# EasyEDA Pro project 15届国（未完成）.epro, board 15F_PCB
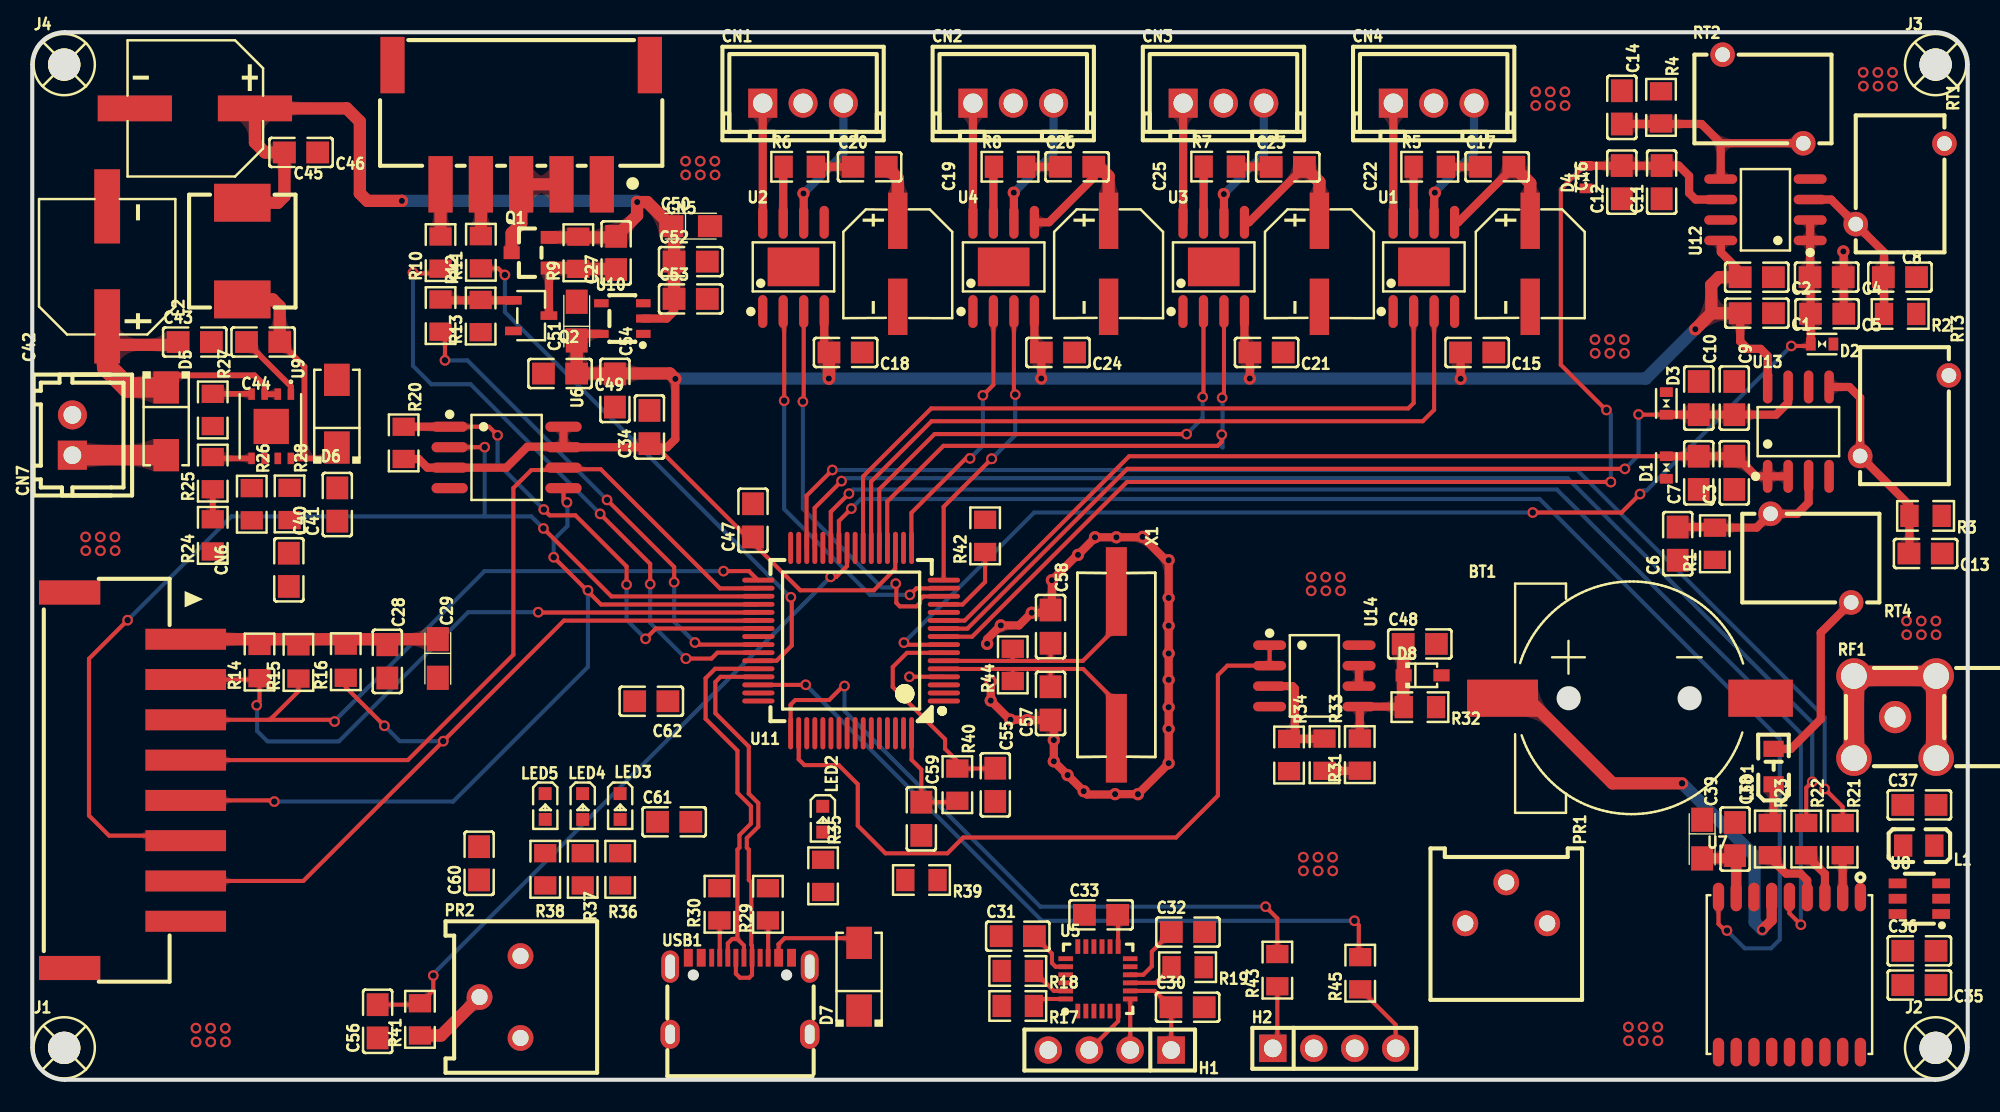
[diagram p4: board, top side]
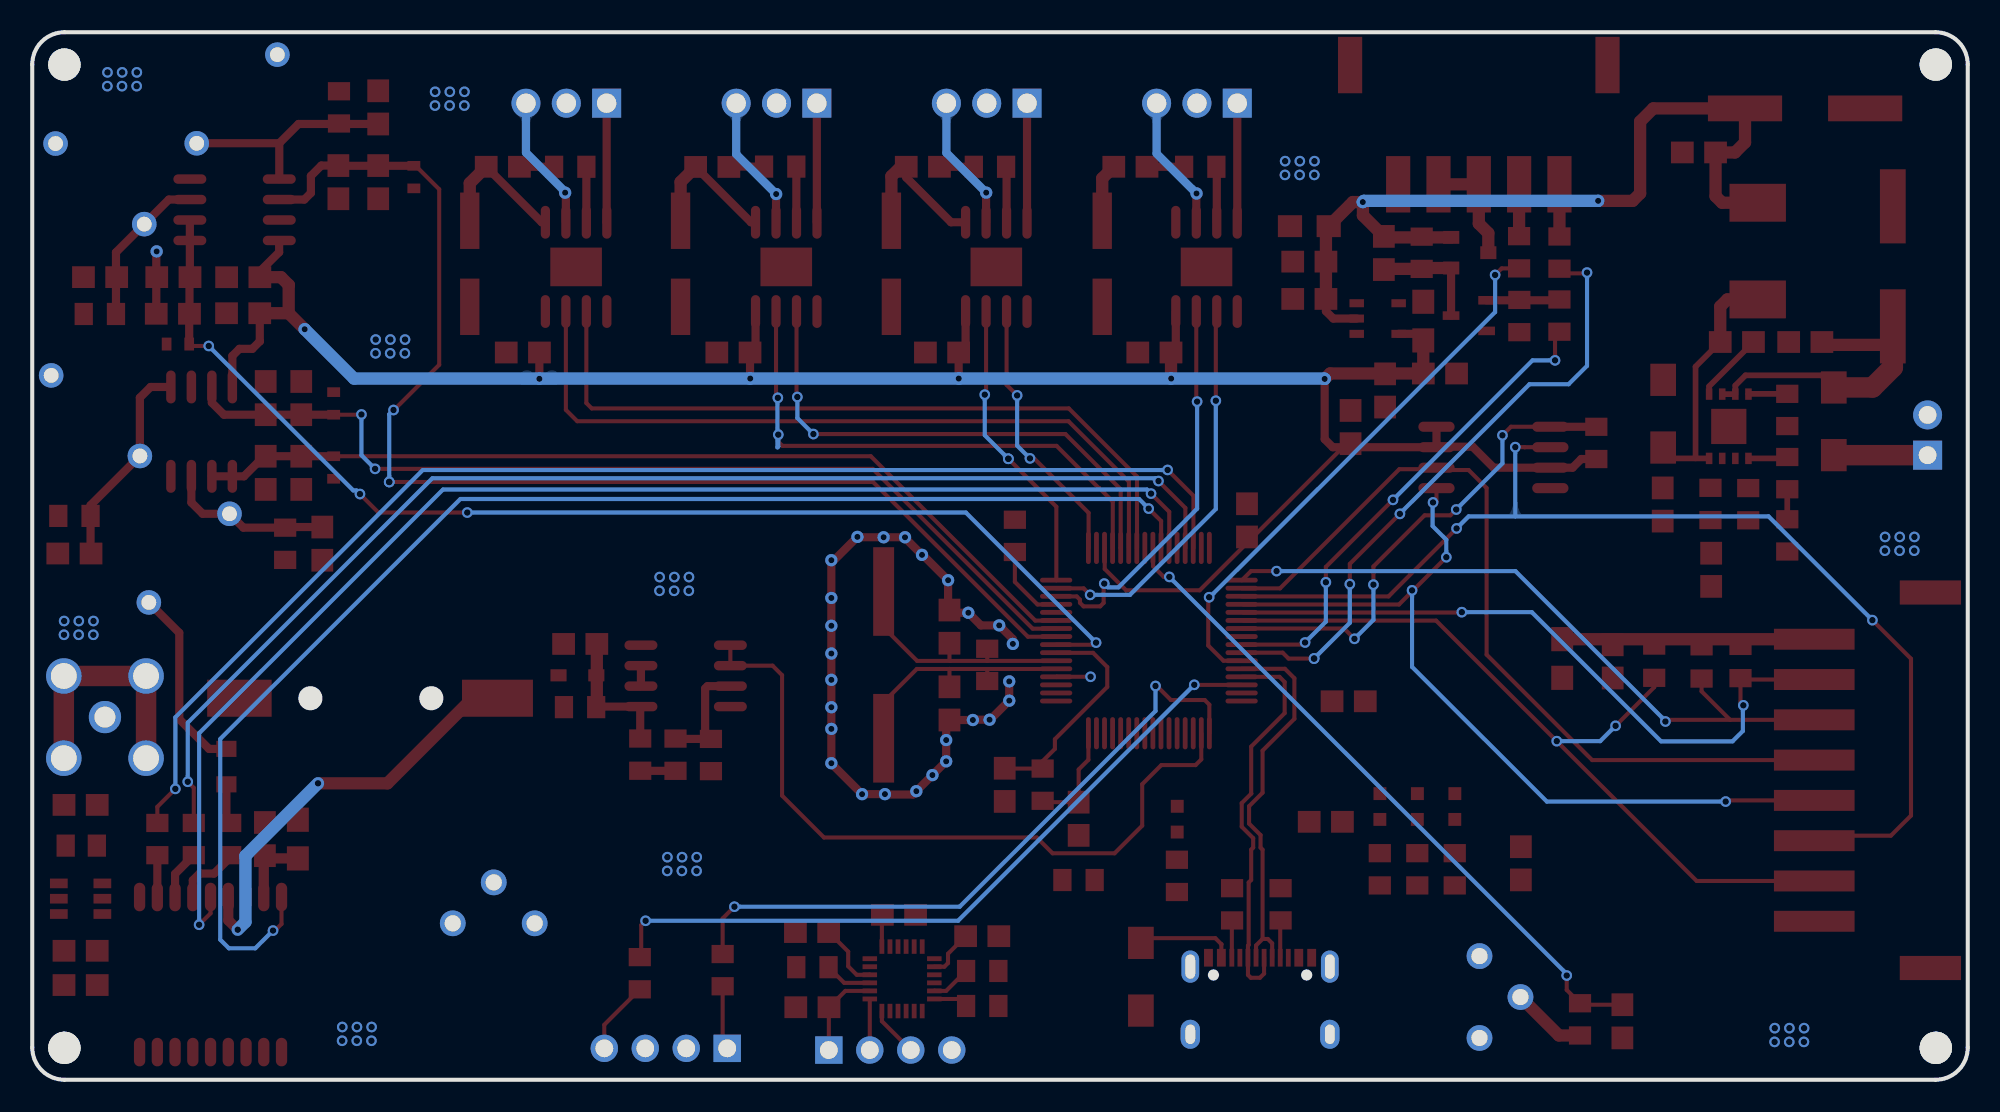
[diagram p5: board, bottom side, seen from below]

Outline 120 x 65 mm; copper layers: Top Layer, Bottom Layer. Coordinates in mm from the lower left corner of the outline.
Outline path: 0,63 0,2 arc(0.59,0.59) 2,0 118,0 arc(119.41,0.59) 120,2 120,63 arc(119.41,64.41) 118,65 2,65 arc(0.59,64.41) 0,63
Stack: Top Layer 0.035mm / Dielectric1 1.51mm FR4 er 4.5 / Bottom Layer 0.035mm

## Design rules (mm)
net USB_DN: DP2
net USB_DP: DP2
net OSC_OUT: DP1
net OSC_IN: DP1
template: 自定义配置
spacing copperThickness1oz (default): track to track 0.203, other pairs 0.165 to 0.203
spacing copperThickness2oz: track to track 0.203, other pairs 0.152 to 0.3
track width copperThickness1oz (default): min 0.254, default 0.254, max 2.54
track width copperThickness2oz: min 0.203, default 0.254, max 2.54
differential pair differentialPair (default): width min 0.254, default 0.254, max 2.54; gap min 0.203, default 0.203
via viaSize (default): diameter min 0.61, default 0.635, max 10; hole min 0.305, default 0.381, max 6.299

## Placement (name value [footprint] x y rotation side)
BT1  CR1220-A  [BAT-SMD_CR1220-2]  99.16 23.68 0 top
C1  100nF  [C0805]  106.92 47.56 180 top
C2  100nF  [C0805]  106.92 49.8 180 top
C3  100nF  [C0805]  105.53 37.66 90 top
C4  100nF  [C0805]  111.25 49.8 180 top
C5  10nF  [C0805]  111.28 47.53 180 top
C6  100nF  [C0805]  102.02 33.27 90 top
C7  10nF  [C0805]  103.32 37.66 90 top
C8  100nF  [C0805]  115.8 49.8 180 top
C9  100nF  [C0805]  105.53 42.3 270 top
C10  10nF  [C0805]  103.32 42.3 270 top
C11  100nF  [C0805]  101.02 55.7 90 top
C12  10nF  [C0805]  98.55 55.7 90 top
C13  100nF  [C0805]  117.39 32.65 180 top
C14  100nF  [C0805]  98.55 60.34 270 top
C15  100nF  [C0805]  89.58 45.13 180 top
C16  100uF  [CAP-SMD_BD6.3-L6.6-W6.6-LS7.2-FD]  92.88 50.63 270 top
C17  100nF  [C0805]  90.83 56.65 0 top
C18  100nF  [C0805]  50.43 45.13 180 top
C19  100uF  [CAP-SMD_BD6.3-L6.6-W6.6-LS7.2-FD]  53.66 50.63 270 top
C20  100nF  [C0805]  51.91 56.65 0 top
C21  100nF  [C0805]  76.53 45.13 180 top
C22  100uF  [CAP-SMD_BD6.3-L6.6-W6.6-LS7.2-FD]  79.8 50.63 270 top
C23  100nF  [C0805]  77.84 56.64 0 top
C24  100nF  [C0805]  63.59 45.13 180 top
C25  100uF  [CAP-SMD_BD6.3-L6.6-W6.6-LS7.2-FD]  66.73 50.63 270 top
C26  100nF  [C0805]  64.78 56.65 0 top
C27  100nF  [C0805]  36.2 51.3 90 top
C28  100nF  [C0805]  22.01 25.96 270 top
C29  22uF  [CASE-A_3216]  25.14 26.14 270 top
C30  100nF  [C0805]  71.63 4.5 0 top
C31  2200pF  [C0805]  61.1 8.91 0 top
C32  100nF  [C0805]  71.65 9.16 0 top
C33  100nF  [C0805]  66.26 10.23 0 top
C34  100nF  [C0805]  38.26 40.5 90 top
C35  100nF  [C0805]  117 5.88 180 top
C36  100nF  [C0805]  117 8 0 top
C37  470pF  [C0805]  117 17.06 0 top
C38  100nF  [C0805]  105.57 14.94 270 top
C39  22uF  [CASE-A_3216]  103.53 14.94 270 top
C40  10nF  [C0805]  15.91 31.64 270 top
C41  15pF  [C0805]  18.91 35.69 90 top
C42  220uF  [CAP-SMD_BD8.0-L8.3-W8.3-LS9.3-FD]  4.65 50.47 90 top
C43  100nF  [C0805]  10.07 45.78 0 top
C44  100nF  [C0805]  14.32 45.78 180 top
C45  220uF  [CAP-SMD_BD8.0-L8.3-W8.3-LS9.3-FD]  10.08 60.27 180 top
C46  100nF  [C0805]  16.67 57.54 180 top
C47  100nF  [C0805]  44.69 34.71 90 top
C48  100nF  [C0805]  86.03 27.04 0 top
C49  100nF  [C0805]  32.72 43.82 180 top
C50  22uF  [CASE-A_3216]  40.82 52.97 0 top
C51  22uF  [CASE-A_3216]  33.76 47.08 90 top
C52  100nF  [C0805]  40.82 50.77 0 top
C53  10nF  [C0805]  40.82 48.45 0 top
C54  10nF  [C0805]  36.12 42.77 270 top
C55  100nF  [C0805]  59.71 18.3 270 top
C56  10nF  [C0805]  21.41 3.63 90 top
C57  20pF  [C0805]  63.13 23.35 90 top
C58  20pF  [C0805]  63.13 28.12 270 top
C59  100nF  [C0805]  55.12 16.19 270 top
C60  100nF  [C0805]  27.71 13.43 90 top
C61  100nF  [C0805]  39.8 16.01 0 top
C62  100nF  [C0805]  38.38 23.48 180 top
CN1  2.54-1*3P  [CONN-TH_C722693]  47.79 60.6 0 top
CN2  2.54-1*3P  [CONN-TH_C722693]  60.82 60.6 0 top
CN3  2.54-1*3P  [CONN-TH_C722693]  73.86 60.6 0 top
CN4  2.54-1*3P  [CONN-TH_C722693]  86.89 60.6 0 top
CN5  ZX-XH2.54-5PWT  [CONN-SMD_5P-P2.54_MEGASTAR_ZX-XH2.54-5PWT]  30.31 59.26 180 top
CN6  2.54-8P WT  [CONN-SMD_8P-P2.50_2.54-8P-WT]  5.92 18.58 270 top
CN7  ZX-XH2.54-2PZZ  [CONN-TH_2P-P2.50_HX25003-2A]  2.49 40 90 top
D1  H3V3LD5B  [SOD-523F_L1.7-W0.9-LS1.7-BI]  101.31 37.99 90 top
D2  H3V3LD5B  [SOD-523F_L1.7-W0.9-LS1.7-BI]  110.97 45.65 180 top
D3  H3V3LD5B  [SOD-523F_L1.7-W0.9-LS1.7-BI]  101.31 41.97 270 top
D4  H3V3LD5B  [SOD-523F_L1.7-W0.9-LS1.7-BI]  96.34 56.01 90 top
D5  SS34  [SMA_L4.3-W2.5-LS5.0-RD]  8.3 40.86 270 top
D6  SS34  [SMA_L4.3-W2.5-LS5.0-RD]  18.89 41.33 90 top
D7  SS34  [SMA_L4.3-W2.5-LS5.0-RD]  51.26 6.39 90 top
D8  BZT52C3V3S  [SOD-323_L1.8-W1.3-LS2.5-RD]  86.2 25.1 0 top
H1  -  [HDR-TH_4P-P2.54-V-F]  66.8 1.84 180 top
H2  -  [HDR-TH_4P-P2.54-V-M]  80.72 1.95 0 top
J1  -  [M2螺丝]  1.98 1.98 0 top
J2  -  [M2螺丝]  118.01 1.98 0 top
J3  -  [M2螺丝]  118.01 62.99 0 top
J4  -  [M2螺丝]  1.98 62.99 0 top
L1  6.8nH  [L0805]  116.96 14.53 180 top
L2  10uH  [IND-SMD_L7.3-W6.8]  13.02 51.42 90 top
LED1  -  [LED_0805]  107.97 19.48 90 top
LED2  -  [LED_0603]  49.02 16.12 270 top
LED3  -  [LED_0603]  36.45 16.9 270 top
LED4  -  [LED_0603]  34.13 16.9 270 top
LED5  -  [LED_0603]  31.81 16.9 270 top
PR1  10K  [R_3386P]  91.39 9.71 270 top
PR2  10K  [R_3386P]  30.27 5.13 0 top
Q1  AO3401A  [SOT-23_L2.9-W1.3-P1.90-LS2.4-BR]  30.87 51.32 0 top
Q2  S8050 J3Y  [SOT-23-3_L3.0-W1.7-P0.95-LS2.9-BR]  30.93 47.42 180 top
R1  4.7K  [R0805]  104.32 33.26 90 top
R2  4.7K  [R0805]  115.81 47.52 180 top
R3  4.7K  [R0805]  117.39 34.99 180 top
R4  4.7K  [R0805]  100.98 60.34 270 top
R5  0.1R  [R0805]  86.65 56.65 0 top
R6  0.1R  [R0805]  47.58 56.65 0 top
R7  0.1R  [R0805]  73.63 56.66 0 top
R8  0.1R  [R0805]  60.62 56.65 0 top
R9  10K  [R0805]  33.86 51.32 90 top
R10  1K  [R0805]  25.31 51.33 90 top
R11  1K  [R0805]  27.82 51.35 90 top
R12  4.7K  [R0805]  25.32 47.42 270 top
R13  4.7K  [R0805]  27.8 47.39 90 top
R14  10K  [R0805]  14.09 25.92 90 top
R15  10K  [R0805]  16.5 25.9 90 top
R16  10K  [R0805]  19.44 25.94 90 top
R17  10K  [R0805]  61.1 4.58 180 top
R18  10K  [R0805]  61.1 6.75 180 top
R19  10K  [R0805]  71.63 6.99 180 top
R20  10K  [R0805]  23.03 39.52 270 top
R21  330R  [R0805]  112.25 14.94 270 top
R22  330R  [R0805]  109.99 14.94 270 top
R23  330R  [R0805]  107.73 14.94 270 top
R24  ADJ  [R0805]  11.19 33.78 90 top
R25  10K  [R0805]  11.19 37.64 90 top
R26  ADJ  [R0805]  13.61 35.72 270 top
R27  47K  [R0805]  11.19 41.56 270 top
R28  27K  [R0805]  15.95 35.73 270 top
R29  5.1K  [R0805]  45.61 10.89 90 top
R30  5.1K  [R0805]  42.6 10.89 90 top
R31  10K  [R0805]  82.31 20.17 90 top
R32  2K  [R0805]  86.03 23.12 180 top
R33  10K  [R0805]  80.12 20.17 270 top
R34  2K  [R0805]  77.92 20.15 270 top
R35  300R  [R0805]  49.03 12.65 270 top
R36  300R  [R0805]  36.45 13.06 270 top
R37  300R  [R0805]  34.13 13.06 270 top
R38  300R  [R0805]  31.81 13.06 270 top
R39  10K  [R0805]  55.13 12.39 180 top
R40  10K  [R0805]  57.36 18.31 270 top
R41  10K  [R0805]  24.04 3.75 90 top
R42  0R  [R0805]  59.08 33.75 90 top
R43  100R  [R0805]  77.2 6.8 90 top
R44  1M  [R0805]  60.79 25.74 90 top
R45  100R  [R0805]  82.33 6.61 90 top
RF1  BWSMA-KWE-Z001  [SMA-TH_BWSMA-KWE-Z001]  115.49 22.5 0 top
RT1  NTC 5D-7  [RES-TH_L8.5-W5.5-P5.00-D0.6-S5.50]  115.81 55.59 270 top
RT2  NTC 5D-7  [RES-TH_L8.5-W5.5-P5.00-D0.6-S5.50]  107.3 60.86 0 top
RT3  NTC 5D-7  [RES-TH_L8.5-W5.5-P5.00-D0.6-S5.50]  116.08 41.21 270 top
RT4  NTC 5D-7  [RES-TH_L8.5-W5.5-P5.00-D0.6-S5.50]  110.27 32.37 180 top
U1  TB67H450FNG,EL  [HSOP-8_L5.0-W4.0-P1.27-LS6.2-BL-EP]  86.28 50.44 0 top
U2  TB67H450FNG,EL  [HSOP-8_L5.0-W4.0-P1.27-LS6.2-BL-EP]  47.19 50.44 0 top
U3  TB67H450FNG,EL  [HSOP-8_L5.0-W4.0-P1.27-LS6.2-BL-EP]  73.25 50.44 0 top
U4  TB67H450FNG,EL  [HSOP-8_L5.0-W4.0-P1.27-LS6.2-BL-EP]  60.23 50.44 0 top
U5  MPU6050  [QFN-24_L4.0-W4.0-P0.50-BL]  66.07 6.26 0 top
U6  W25Q32JVSSIQ  [SOIC-8_L5.3-W5.3-P1.27-LS8.0-BL]  29.41 38.62 270 top
U7  ATGM336H-5N31  [GPSM-SMD_ATGM336H-TR]  108.95 6.53 0 top
U8  AT2659S  [SOT-23-6_L2.9-W1.6-P0.95-LS2.8-BR]  117 11.23 0 top
U9  -  [QN_X3DC]  16.03 42.55 270 top
U10  XC6206J332MR-G  [SOT-25_L3.0-W1.6-P0.95-LS2.8-BR]  36.58 47.23 0 top
U11  GD32F307RCT6  [LQFP-64_L10.0-W10.0-P0.50-LS12.0-BL]  50.77 27.25 90 top
U12  GS8552-SR  [SOIC-8_L4.9-W3.9-P1.27-LS6.0-BL]  107.46 53.98 90 top
U13  GS8552-SR  [SOIC-8_L4.9-W3.9-P1.27-LS6.0-BL]  109.5 40.22 0 top
U14  GS8552-SR  [SOIC-8_L4.9-W3.9-P1.27-LS6.0-BL]  79.49 25.06 270 top
USB1  TYPE-C 16PIN 2MD(073)  [USB-C-SMD_TYPE-C-6PIN-2MD-073]  43.88 5.2 0 top
X1  25MHz  [HC-49S_L11.4-W4.8]  67.21 25.74 270 top

## Footprints (pads in the part's own frame, mm; a bottom-side part is the same pattern mirrored in y, then rotated)
BAT-SMD_CR1220-2
  rect 4.4x2.3 smd: 1(-8,0)
  rect 4x2.3 smd: 2(8,0)
C0805
  rect 1.41x1.35 smd: 1(-1.03,0) 2(1.03,0)
CAP-SMD_BD6.3-L6.6-W6.6-LS7.2-FD
  rect 3.5x1.2 smd: 1(-2.67,0) 2(2.67,0)
CAP-SMD_BD8.0-L8.3-W8.3-LS9.3-FD
  rect 4.6x1.6 smd: 1(-3.724,0) 2(3.724,0)
CASE-A_3216
  rect 1.5x1.359 smd: 1(-1.2,0) 2(1.2,0)
CONN-SMD_5P-P2.54_MEGASTAR_ZX-XH2.54-5PWT
  rect 1.5x3.5 smd: 1(-5,3.7) 2(-2.5,3.7) 3(0,3.7) 4(2.5,3.7) 5(5,3.7) 6(7.98,-3.7) 7(-7.98,-3.7)
CONN-SMD_8P-P2.50_2.54-8P-WT
  rect 1.3x5 smd: 1(-8.75,3.6) 2(-6.25,3.6) 3(-3.75,3.6) 4(-1.25,3.6) 5(1.25,3.6) 6(3.75,3.6) 7(6.25,3.6) 8(8.75,3.6)
  rect 1.5x3.8 smd: 9(11.65,-3.6) 10(-11.65,-3.6)
CONN-TH_2P-P2.50_HX25003-2A
  rect 1.8x1.8 hole 1.1: 1(-1.25,0)
  round 1.8 hole 1.1: 2(1.25,0)
CONN-TH_C722693
  rect 1.8x1.8 hole 1.2: 1(-2.5,0)
  round 1.8 hole 1.2: 2(0,0) 3(2.5,0)
GPSM-SMD_ATGM336H-TR
  oval 0.701x1.773 smd: 1(4.399,4.811) 2(3.3,4.811) 3(2.2,4.811) 4(1.1,4.811) 5(0,4.811) 6(-1.1,4.811) 7(-2.2,4.811) 8(-3.3,4.811) 9(-4.399,4.811) 10(-4.399,-4.811) 11(-3.3,-4.811) 12(-2.2,-4.811) 13(-1.1,-4.811) 14(0,-4.811) 15(1.1,-4.811) 16(2.2,-4.811) 17(3.3,-4.811) 18(4.399,-4.811)
HC-49S_L11.4-W4.8
  rect 5.5x1.3 smd: 1(-4.553,0) 2(4.553,0)
HDR-TH_4P-P2.54-V-F
  rect 1.7x1.7 hole 1.1: 1(-3.81,0)
  round 1.7 hole 1.1: 2(-1.27,0) 3(1.27,0) 4(3.81,0)
HDR-TH_4P-P2.54-V-M
  rect 1.7x1.7 hole 1.1: 1(-3.81,0)
  round 1.7 hole 1.1: 2(-1.27,0) 3(1.27,0) 4(3.81,0)
HSOP-8_L5.0-W4.0-P1.27-LS6.2-BL-EP
  oval 0.574x2.038 smd: 1(-1.905,-2.769) 2(-0.635,-2.769) 3(0.635,-2.769) 4(1.905,-2.769) 5(1.905,2.769) 6(0.635,2.769) 7(-0.635,2.769) 8(-1.905,2.769)
  rect 3.2x2.4 smd: 9(0,0)
IND-SMD_L7.3-W6.8
  rect 2.35x3.5 smd: 1(-3,0) 2(3,0)
L0805
  rect 1.133x1.377 smd: 1(-0.966,0) 2(0.966,0)
LED_0603
  rect 0.8x0.8 smd: 1(-0.851,-0.01) 2(0.75,-0.005)
LED_0805
  rect 1x1.25 smd: 1(-1.15,0.005) 2(1.05,0.005)
LQFP-64_L10.0-W10.0-P0.50-LS12.0-BL
  oval 0.3x2 smd: 1(-3.75,-5.75) 2(-3.25,-5.75) 3(-2.75,-5.75) 4(-2.25,-5.75) 5(-1.75,-5.75) 6(-1.25,-5.75) 7(-0.75,-5.75) 8(-0.25,-5.75) 9(0.25,-5.75) 10(0.75,-5.75) 11(1.25,-5.75) 12(1.75,-5.75) 13(2.25,-5.75) 14(2.75,-5.75) 15(3.25,-5.75) 16(3.75,-5.75) 33(3.75,5.75) 34(3.25,5.75) 35(2.75,5.75) 36(2.25,5.75) 37(1.75,5.75) 38(1.25,5.75) 39(0.75,5.75) 40(0.25,5.75) 41(-0.25,5.75) 42(-0.75,5.75) 43(-1.25,5.75) 44(-1.75,5.75) 45(-2.25,5.75) 46(-2.75,5.75) 47(-3.25,5.75) 48(-3.75,5.75)
  oval 2x0.3 smd: 17(5.75,-3.75) 18(5.75,-3.25) 19(5.75,-2.75) 20(5.75,-2.25) 21(5.75,-1.75) 22(5.75,-1.25) 23(5.75,-0.75) 24(5.75,-0.25) 25(5.75,0.25) 26(5.75,0.75) 27(5.75,1.25) 28(5.75,1.75) 29(5.75,2.25) 30(5.75,2.75) 31(5.75,3.25) 32(5.75,3.75) 49(-5.75,3.75) 50(-5.75,3.25) 51(-5.75,2.75) 52(-5.75,2.25) 53(-5.75,1.75) 54(-5.75,1.25) 55(-5.75,0.75) 56(-5.75,0.25) 57(-5.75,-0.25) 58(-5.75,-0.75) 59(-5.75,-1.25) 60(-5.75,-1.75) 61(-5.75,-2.25) 62(-5.75,-2.75) 63(-5.75,-3.25) 64(-5.75,-3.75)
M2螺丝
  round 2 hole 2: 1(0,0)
QFN-24_L4.0-W4.0-P0.50-BL
  rect 0.3x0.9 smd: 1(-1.25,-2) 2(-0.75,-2) 3(-0.25,-2) 4(0.25,-2) 5(0.75,-2) 6(1.25,-2) 13(1.25,2) 14(0.75,2) 15(0.25,2) 16(-0.25,2) 17(-0.75,2) 18(-1.25,2)
  rect 0.9x0.3 smd: 7(2,-1.25) 8(2,-0.75) 9(2,-0.25) 10(2,0.25) 11(2,0.75) 12(2,1.25) 19(-2,1.25) 20(-2,0.75) 21(-2,0.25) 22(-2,-0.25) 23(-2,-0.75) 24(-2,-1.25)
QN_X3DC
  rect 0.711x0.406 smd: 1(0,0) 2(0,-0.813) 3(0,-1.625) 4(0,-2.438) 5(3.988,-2.438) 6(3.988,-1.625) 7(3.988,-0.813) 8(3.988,0)
  rect 2.184x2.184 smd: 9(2.006,-1.219)
R0805
  rect 1.133x1.377 smd: 1(-1,0) 2(1,0)
R_3386P
  round 1.6 hole 1.001: 1(0,-2.54) 2(-2.54,0) 3(0,2.54)
RES-TH_L8.5-W5.5-P5.00-D0.6-S5.50
  round 1.524 hole 0.914: 1(-2.5,2.75) 2(2.5,-2.75)
SMA-TH_BWSMA-KWE-Z001
  round 2.2 hole 1.6: 1(-2.55,-2.55) 2(-2.55,2.55) 3(2.55,2.55) 4(2.55,-2.55)
  round 2 hole 1.3: 5(0,0)
SMA_L4.3-W2.5-LS5.0-RD
  rect 2x1.593 smd: 1(-2.1,0) 2(2.1,0)
SOD-323_L1.8-W1.3-LS2.5-RD
  rect 1x0.75 smd: 1(-1.173,0) 2(1.173,0)
SOD-523F_L1.7-W0.9-LS1.7-BI
  rect 0.6x0.8 smd: 1(-0.7,0) 2(0.7,0)
SOIC-8_L4.9-W3.9-P1.27-LS6.0-BL
  oval 0.588x2.045 smd: 1(-1.905,-2.772) 2(-0.635,-2.772) 3(0.635,-2.772) 4(1.905,-2.772) 5(1.905,2.772) 6(0.635,2.772) 7(-0.635,2.772) 8(-1.905,2.772)
SOIC-8_L5.3-W5.3-P1.27-LS8.0-BL
  oval 0.63x2.25 smd: 1(-1.905,-3.53) 2(-0.635,-3.53) 3(0.635,-3.53) 4(1.905,-3.53) 5(1.905,3.53) 6(0.635,3.53) 7(-0.635,3.53) 8(-1.905,3.53)
SOT-23-3_L3.0-W1.7-P0.95-LS2.9-BR
  rect 1.038x0.532 smd: 1(1.101,-0.95) 2(1.101,0.95) 3(-1.101,0)
SOT-23-6_L2.9-W1.6-P0.95-LS2.8-BR
  rect 1.1x0.6 smd: 1(1.35,-0.95) 2(1.35,0) 3(1.35,0.95) 4(-1.35,0.95) 5(-1.35,0) 6(-1.35,-0.95)
SOT-23_L2.9-W1.3-P1.90-LS2.4-BR
  rect 1x0.8 smd: 1(1.15,-0.95) 2(1.15,0.95) 3(-1.15,0)
SOT-25_L3.0-W1.6-P0.95-LS2.8-BR
  rect 0.9x0.5 smd: 1(1.3,-0.95) 2(1.3,0) 3(1.3,0.95) 4(-1.3,0.95) 5(-1.3,-0.95)
USB-C-SMD_TYPE-C-6PIN-2MD-073
  rect 0.55x1.1 smd: 1(-3.2,2.375) 2(-2.4,2.375) 11(2.4,2.375) 12(3.2,2.375)
  rect 0.3x1.1 smd: 3(-1.75,2.375) 4(-1.25,2.375) 5(-0.75,2.375) 6(-0.25,2.375) 7(0.25,2.375) 8(0.75,2.375) 9(1.25,2.375) 10(1.75,2.375)
  oval 1.1x2 hole 0.6x1.5: 13(-4.325,1.825) 14(4.325,1.825)
  oval 1.2x1.8 hole 0.6x1.2: 13(-4.325,-2.375) 14(4.325,-2.375)

## Nets
As in the schematic.

Pads without a net: U5 2 3 4 5 14 15 16 17 19 21 22; U7 7 13 15 16 17 18; U10 1 3; U11 28 40 51 52 54 55 56 61 62; USB1 3 9

## Via types
v1: diameter 0.762, hole 0.381, Top Layer to Bottom Layer, 39 vias
v2: diameter 0.66, hole 0.406, Top Layer to Bottom Layer, 127 vias

## Routing (per net, layer and track width the routed paths; a pad name or vN(x,y) marks a point on that pad's centre or on a via; arc(x,y) is an arc through that point)
+5V0: length 55.5
  Top Layer w0.508: C53.1 39.79,47.69 39.34,47.23 U10.2
  Top Layer w0.762: 33.81,52.27 36.14,52.27 C27.2 37.5,53.63 37.5,54.45 37.51,54.46 38.13,54.46 C50.1 39.79,52.8 C52.1 C53.1 ; 33.81,52.27 Q1.2 ; 33.81,52.27 R9.2 ; v1(22.92,54.54) 20.77,54.54 20.31,55 20.31,59.46 19.5,60.27 C45.1 13.81,58.16 14.43,57.54 C46.2 15.64,54.82 15.23,54.42 L2.2
  Bottom Layer w0.762: v1(22.92,54.54) 37.43,54.54 v1(37.51,54.46)
GND: length 73.2
  Top Layer w0.508: C26.1 R8.2 ; C57.1 v1(61.68,22.32) 61.66,22.34 v1(60.65,22.34) 60.61,22.34 v1(59.43,23.53) 59.43,23.53 v1(59.43,24.72) ; v1(59.2,27.05) 59.2,27.35 v1(60.05,28.19) 61.18,28.19 v1(61.97,28.98) 62.65,28.98 63.13,29.46 ; C23.1 76.79,56.66 R7.2 ; R5.2 C17.1 ; v1(112.29,51.4) 112.31,51.38 112.31,49.77 ; C5.1 112.31,49.77 ; 112.31,49.77 C4.1 ; R6.2 C20.1 ; 63.13,29.46 C58.1 ; 63.13,29.46 63.22,29.55 v1(63.22,31) 64.79,32.57 v1(64.84,32.57) 65.89,33.62 v1(65.89,33.66) v1(67.22,33.66) 68.82,33.66 v1(68.84,33.69) 70.29,32.24 v1(70.46,32.24) v1(70.46,29.9) v1(70.46,28.17) v1(70.46,26.45) v1(70.46,24.82) v1(70.46,23.11) v1(70.46,21.77) v1(70.46,19.64) 70.46,19.63 v1(68.55,17.72) 68.55,17.72 v1(67.13,17.72) 67.11,17.7 65.4,17.7 v1(65.19,17.91) v1(64.19,18.91) v1(63.34,19.76) v1(63.34,21.08) 63.34,22.18
  Top Layer w1.27: RF1.1 RF1.2 RF1.3 RF1.4
  Bottom Layer w0.508: 112.25,51.4 112.26,51.4 v1(112.29,51.4)
  vias: v2(3.31,33.68) v2(3.32,32.83) v2(4.22,33.68) v2(4.23,32.83) v2(5.13,33.68) v2(5.14,32.83) v2(10.15,3.2) v2(10.16,2.35) v2(11.06,3.2) v2(11.07,2.35) v2(11.97,3.2) v2(11.98,2.35) v2(40.5,57) v2(40.51,56.15) v2(41.41,57) v2(41.42,56.15) v2(42.32,57) v2(42.33,56.15) v2(78.8,13.81) v2(78.81,12.96) v2(79.28,31.19) v2(79.29,30.34) v2(79.71,13.81) v2(79.72,12.96) v2(80.19,31.19) v2(80.2,30.34) v2(80.62,13.81) v2(80.63,12.96) v2(81.1,31.19) v2(81.11,30.34) v2(93.2,61.3) v2(93.21,60.45) v2(94.11,61.3) v2(94.12,60.45) v2(95.02,61.3) v2(95.03,60.45) v2(96.89,45.93) v2(96.9,45.08) v2(97.8,45.93) v2(97.81,45.08) v2(98.71,45.93) v2(98.72,45.08) v2(98.96,3.27) v2(98.97,2.42) v2(99.87,3.27) v2(99.88,2.42) v2(100.78,3.27) v2(100.79,2.42) v2(113.52,62.51) v2(113.53,61.66) v2(114.43,62.51) v2(114.44,61.66) v2(115.34,62.51) v2(115.35,61.66) v2(116.21,28.47) v2(116.22,27.61) v2(117.11,28.47) v2(117.12,27.61) v2(118.02,28.47) v2(118.03,27.61)
VBAT: length 38.8
  Top Layer w0.508: U1.5 88.41,53.21 C17.2 ; R33.2 82.3,19.17 R31.1 ; U4.5 63.04,53.21 65.81,55.99 C26.2 ; C23.2 75.44,53.21 U3.5
  Top Layer w0.762: C20.2 53.66,55.93 C19.1 ; C23.2 79.8,55.71 C22.1 ; C17.2 92.88,55.63 C16.1 ; C25.1 66.73,56.07 66.15,56.65 C26.2
  Top Layer w1.27: D5.2 8.3,38.75 CN7.1
VBUS: length 6.1
  Top Layer w0.254: 51.26,8.49 50.97,8.79 46.65,8.79 46.27,8.41 46.28,8.4 USB1.11
VDD: length 193.9
  Top Layer w0.254: 53.51,32.99 53.51,31.7 52.18,30.37 47.62,30.37 38.74,39.25 38.52,39.47 C34.1 ; C33.2 67.32,10.21 U5.13 ; R40.2 57.27,17.22 C59.1 55.12,19.25 54.52,19.85 U11.64 ; U5.8 69.59,5.51 C30.1 70.61,4.49 H1.1
  Top Layer w0.508: U4.4 62.13,45.56 C24.2 62.56,43.52 v1(62.56,43.51) ; U6.7 32.91,39.28 30.7,39.28 29.4,37.98 U6.3 24.5,37.98 23.96,38.52 R20.2 ; U6.7 U6.8 ; U6.7 38.05,39.25 ; U10.5 34.16,46.28 C51.1 ; v1(75.49,43.51) 75.5,43.52 C21.2 75.16,45.47 U3.4 ; RT4.1 110.89,27.73 110.89,22.38 109.04,20.53 107.96,20.53 ; C2.2 105.89,50.16 104.69,51.35 104.69,52.07 U12.8 ; U13.8 107.59,44.92 107.16,45.35 106.36,45.35 105.89,45.82 105.89,45.83 C1.2 ; C18.2 49.1,45.42 U2.4 ; 33.76,43.83 C49.1 ; C15.2 88.56,45.12 v1(88.56,43.5) ; 38.74,39.25 39.37,39.25 39.87,39.75 v1(39.87,43.49)
  Top Layer w0.635: 105.41,13.74 105.65,13.49 105.65,11.34 ; 105.41,13.74 C39.2 ; 105.41,13.74 C38.2
  Top Layer w0.762: v1(39.87,43.49) 39.53,43.83 36.1,43.83 ; 36.1,43.83 33.76,43.83 C51.1 ; 36.1,43.83 C54.1 ; v1(103.11,46.57) 104.1,47.56 ; 104.1,47.56 104.1,49.31 104.09,49.32 104.58,49.8 C2.2 ; 104.1,47.56 C1.2 ; CN6.1 25.14,27.33 C29.1 ; v1(49.39,43.51) 49.4,43.52 C18.2
  Bottom Layer w0.508: v1(88.56,43.5) 88.56,43.51
  Bottom Layer w0.762: v1(39.87,43.49) 39.89,43.51 v1(49.39,43.51) 100.05,43.51 v1(103.11,46.57)
4G_PWR: length 30.6
  Top Layer w0.254: U11.41 41.22,27 v2(41.09,27.13) ; R12.2 25.59,46.14 v2(25.59,44.64) ; v2(39.8,30.87) 39.8,31.82 v2(35.64,35.98)
  Bottom Layer w0.254: v2(25.59,44.64) 26.98,44.64 v2(35.64,35.98) ; v2(39.8,30.87) 39.8,28.42 v2(41.09,27.13)
4G_RXD: length 38.9
  Top Layer w0.254: R10.1 25.02,50.04 23.6,50.04 v2(23.6,50.09) ; v2(40.53,26.14) 42.11,26.14 42.48,26.5 U11.42 ; v2(35.21,35.11) 38.31,32.01 v2(38.31,30.76)
  Bottom Layer w0.254: v2(35.21,35.11) 35.21,35.13 27.18,43.16 24.74,43.16 23.6,44.3 v2(23.6,50.09) ; v2(38.31,30.76) 38.31,28.35 v2(40.53,26.14)
4G_TXD: length 34.5
  Top Layer w0.254: U11.43 46.15,26 47.09,26.94 47.09,29.89 v2(47.03,29.94) ; R11.1 28.9,50.35 v2(29.3,49.94)
  Bottom Layer w0.254: v2(29.3,49.94) 29.3,47.64 47,29.94 v2(47.03,29.94)
ADC_MOT_TEMP1: length 74.1
  Top Layer w0.254: v2(99.68,36.34) 98.53,35.2 v2(93.03,35.2) ; v2(109.06,45.53) 110.15,45.53 D2.2 ; 56.51,26.99 54.18,26.99 v2(54.04,27.12)
  Top Layer w0.508: 110.23,49.81 C4.2 ; 110.23,49.81 U12.1 U12.2 ; 110.23,49.81 110.25,49.79 C5.2 110.27,47.51 D2.2
  Bottom Layer w0.254: v2(109.06,45.53) 100.1,36.57 99.91,36.57 v2(99.68,36.34) ; v2(93.03,35.2) 62.12,35.2 v2(54.04,27.12)
ADC_MOT_TEMP2: length 76.9
  Top Layer w0.254: v2(97.87,37.09) 67.87,37.09 58.27,27.49 56.51,27.49 ; v2(97.6,41.56) 97.6,41.53 94.77,44.36 94.77,55.25 96.23,56.71 D4.2
  Top Layer w0.508: U12.6 103.13,54.62 102.72,55.02 102.72,56.08 102.08,56.73 C11.2 101.01,56.71 D4.2
  Bottom Layer w0.254: v2(97.87,37.09) 97.87,41.29 v2(97.6,41.56)
ADC_MOT_TEMP3: length 60.6
  Top Layer w0.254: v2(99.59,41.28) 99.59,41.28 99.6,41.27 D3.2 ; v2(98.75,37.91) 67.89,37.91 57.97,27.99 56.51,27.99
  Top Layer w0.508: D3.2 C10.2 C9.2 108.12,41.27 108.86,42.01 U13.7
  Bottom Layer w0.254: v2(99.59,41.28) 99.59,38.75 v2(98.75,37.91)
ADC_MOT_TEMP4: length 57.1
  Top Layer w0.254: D1.2 68.01,38.69 57.81,28.49 56.51,28.49
  Top Layer w0.508: U13.2 U13.1 106.88,37.44 105.63,38.69 C3.2 C7.2 D1.2
BAT_ADC: length 1.3
  Top Layer w0.508: U14.6 U14.7
BAT_INT: length 45.2
  Top Layer w0.254: U11.50 47.52,19.88 47.87,19.53 50,19.53 51.18,18.34 51.18,15.77 52.9,14.05 56.74,14.05 57.72,15.03 70.91,15.03 73.51,17.63 73.51,25.11 74.1,25.7 U14.2 U14.1
GPS_PWR: length 83.1
  Top Layer w0.254: 108.95,11.34 108.95,10.33 v2(109.65,9.62) ; 49.51,32.99 49.51,35.24 v2(50.63,36.37)
  Bottom Layer w0.254: v2(50.63,36.37) 50.89,36.62 94.53,36.62 109.65,21.5 v2(109.65,9.62)
GPS_RST: length 85.6
  Top Layer w0.254: 104.55,11.34 104.55,9.67 104.96,9.26 v2(105.07,9.26) 105.11,9.3 105.12,9.3 ; v2(50.78,35.44) 50.01,34.67 50.01,32.99 50.01,32.99
  Bottom Layer w0.254: v2(50.78,35.44) 51.38,36.04 93.45,36.04 108.35,21.15 108.35,8.7 107.81,8.16 106.17,8.16 v2(105.07,9.26)
GPS_RXD: length 77.8
  Top Layer w0.254: v2(50.18,37.15) 48.51,35.48 48.51,32.99 ; v2(110.36,18.49) 109.99,18.12 R22.1
  Bottom Layer w0.254: v2(50.18,37.15) 50.35,37.33 95.19,37.33 110.36,22.16 v2(110.36,18.49)
GPS_TXD: length 80.4
  Top Layer w0.254: 48.01,32.99 48.01,36.24 v2(49.61,37.84) ; v2(111.13,18.05) 112.25,16.93 R21.1
  Bottom Layer w0.254: v2(111.13,18.05) 111.13,22.49 95.79,37.83 49.61,37.83 v2(49.61,37.84)
MM_CS: length 30.7
  Top Layer w0.254: v2(36.85,30.72) 36.85,31.85 33.67,35.02 32.08,35.02 v2(31.71,35.38) ; v2(28.85,39.99) 28.32,40.52 U6.1 ; U11.39 38.66,28 v2(38.02,27.36)
  Top Layer w0.508: R20.1 25.87,40.52 U6.1
  Bottom Layer w0.254: v2(31.71,35.38) 28.85,38.25 v2(28.85,39.99) ; v2(36.85,30.72) 36.85,28.54 v2(38.02,27.36)
OSC_IN: length 15.6
  Top Layer w0.254: 63.13,25.49 65.16,25.49 67.21,23.44 67.21,21.19 ; 63.13,25.49 56.51,25.49 ; 63.13,25.49 63.13,25.49 63.13,24.38 ; R44.1 60.79,25.46
OSC_OUT: length 15.7
  Top Layer w0.254: 56.51,25.99 60.78,25.99 ; 60.78,25.99 60.79,26 R44.2 ; 60.78,25.99 63.09,25.99 ; 63.09,25.99 65.14,25.99 67.21,28.06 67.21,30.3 ; 63.09,25.99 63.13,26.03 C58.2
RF_CE: length 42.5
  Top Layer w0.254: CN6.2 14,24.83 R14.1 14.09,23.49 13.91,23.31 v2(13.91,23.24) ; v2(31.37,29.01) 31.39,28.99 44.91,28.99
  Bottom Layer w0.254: v2(13.91,23.24) 13.94,23.21 13.94,21.64 14.58,21 19.01,21 27.03,29.01 v2(31.37,29.01)
RF_CS: length 42.9
  Top Layer w0.254: 14.74,22.33 CN6.3 ; 14.74,22.33 16.5,24.1 R15.1 ; 14.74,22.33 18.64,22.33 v2(18.75,22.23) ; v2(42.85,31.56) 44.44,31.56 45.01,30.99
  Bottom Layer w0.254: v2(18.75,22.23) 18.8,22.29 18.8,22.32 28.04,31.56 v2(42.85,31.56)
RF_IRQ: length 50.1
  Top Layer w0.254: 44.91,28.49 32.96,28.49 v2(25.48,21.01) 16.81,12.34 CN6.7 ; v2(21.83,21.96) 19.44,24.36 R16.1
  Bottom Layer w0.254: v2(21.83,21.96) 22.79,21.01 v2(25.48,21.01)
RF_MISO: length 70.1
  Top Layer w0.254: v2(5.91,28.52) 3.52,26.13 3.52,16.39 4.77,15.15 9.2,15.15 CN6.6 ; U6.2 27.47,39.25 27.47,39.26 v2(28.05,39.26) ; 45.01,29.99 35.91,29.99 v2(31.69,34.21)
  Bottom Layer w0.254: 28.05,34.96 v2(28.05,39.26) ; 28.05,34.96 30.94,34.96 v2(31.69,34.21) ; 28.05,34.96 12.35,34.96 v2(5.91,28.52)
RF_MOSI: length 52
  Top Layer w0.254: U6.5 32.94,35.9 33.15,35.69 v2(33.15,35.82) ; v2(15.01,17.26) 14.94,17.33 CN6.5 ; v2(32.33,32.42) 35.26,29.49 44.91,29.49
  Bottom Layer w0.254: v2(15.01,17.26) 26.09,17.26 34.45,25.62 v2(34.45,30.37) ; v2(33.15,35.82) 33.18,35.8 33.18,34.36 32.33,33.51 v2(32.33,32.42)
RF_SCLK: length 52.2
  Top Layer w0.254: CN6.4 23.28,19.83 29.83,26.38 29.83,36.72 30.94,37.83 32.79,37.83 U6.6 33.03,37.89 35.24,37.89 42.64,30.49 45.01,30.49
S_ADJ: length 42.1
  Top Layer w0.254: v2(24.86,6.47) 24.86,5.57 R41.2 23.95,4.66 C56.2 ; v2(49.5,31.2) 49.85,31.2 50.51,31.86 50.51,32.99
  Bottom Layer w0.254: v2(24.86,6.47) 24.86,6.57 v2(49.5,31.2)
S_SCL: length 2.2
  Top Layer w0.254: R17.1 62.54,5.01 U5.24
S_SDA: length 2.5
  Top Layer w0.254: 64.05,5.53 U5.23 63.34,5.51 R18.1
TIMA_CH1: length 24.6
  Top Layer w0.254: 56.51,29.99 55.24,29.99 55.04,29.79 55.04,29.6 54.82,29.38 53.79,29.38 53.57,29.59 53.57,30.75 v2(53.54,30.79) ; v2(47.78,42.08) 47.83,42.13 U2.3
  Bottom Layer w0.254: 53.46,30.7 53.32,30.56 52.65,30.56 47.78,35.43 v2(47.78,42.08)
TIMA_CH2: length 24.5
  Top Layer w0.254: v2(54.41,30.09) 54.81,30.49 56.51,30.49 ; U2.2 46.62,47.61 v2(46.62,42.14)
  Bottom Layer w0.254: v2(54.41,30.09) 51.94,30.09 46.62,35.41 v2(46.62,42.14)
TIMB_CH1: length 18.6
  Top Layer w0.254: U4.3 60.86,42.57 60.94,42.49 v2(60.94,42.51) ; v2(59.48,38.53) 56.51,35.56 56.51,30.99
  Bottom Layer w0.254: v2(60.94,42.51) 60.94,40 v2(59.48,38.53)
TIMB_CH2: length 16.9
  Top Layer w0.254: 54.51,32.99 54.51,35.18 57.88,38.56 v2(58.14,38.56) ; v2(58.94,42.47) 59.59,43.12 59.59,47.67
  Bottom Layer w0.254: v2(58.94,42.47) 58.94,39.35 v2(58.14,38.56)
TIMC_CH1: length 34.9
  Top Layer w0.254: v2(73.75,40.03) 73.75,39.59 73.49,39.33 56.49,39.33 53.87,36.71 53.84,36.71 53.01,35.88 53.01,32.99 ; U3.3 73.89,42.43 v2(73.77,42.32)
  Bottom Layer w0.254: 73.77,42.31 73.8,42.29 73.8,39.24 73.75,39.29 v2(73.75,40.03)
TIMC_CH2: length 32.2
  Top Layer w0.254: v2(72.57,42.37) 72.62,42.42 U3.2 ; 52.51,32.99 52.52,33 52.52,36.64 55.94,40.07 v2(71.57,40.07)
  Bottom Layer w0.254: v2(71.57,40.07) 72.57,41.06 v2(72.57,42.37)
TIMD_CH1: length 47
  Top Layer w0.254: U1.3 86.92,41.57 86.21,40.86 55.76,40.86 52.01,37.11 52.01,32.99
TIMD_CH2: length 46.1
  Top Layer w0.254: 51.51,32.99 51.51,37.43 55.73,41.66 85.31,41.66 85.65,41.99 U1.2
USB_DN: length 24.1
  Top Layer w0.254: 43.72,8.74 43.72,14.28 43.85,14.4 43.85,15.18 44.56,15.89 44.56,16.97 43.72,17.81 43.72,20.42 41.75,22.4 41.75,24.91 42.34,25.5 U11.44 ; 43.72,8.74 44.13,8.33 USB1.7 ; 43.72,8.74 43.4,8.74 43.13,8.47 USB1.5
USB_DP: length 24.7
  Top Layer w0.254: U11.45 42.67,25 42.35,24.68 42.35,22.75 44.43,20.67 44.43,17.77 44.42,17.76 45.01,17.16 45.01,15.7 44.3,14.99 44.3,14.4 44.43,14.28 44.43,12.4 44.58,12.24 44.58,8.37 44.63,8.32 USB1.8 44.63,6.51 44.45,6.33 43.88,6.33 43.63,6.59 USB1.6
USR_LED4: length 2.1
  Top Layer w0.254: v2(54.39,25.01) 56.49,25.01 56.51,24.99
$1N2668: length 9.8
  Top Layer w0.508: U12.3 111.53,54.62 RT1.2 114.81,51.34 114.81,49.76 ; R2.2 114.81,49.76 ; 114.81,49.76 C8.2
$1N3435: length 14
  Top Layer w0.508: 104.69,58.11 103.49,59.31 100.95,59.31 ; 104.69,58.11 U12.5 ; 104.69,58.11 109.8,58.11 RT2.2 ; C14.2 100.95,59.31 ; 100.95,59.31 R4.2
$1N4661: length 10.4
  Top Layer w0.508: C6.2 104.28,34.3 R1.2 106.91,34.26 RT4.2 109.44,35.12 110.13,35.82 U13.3
$1N4689: length 13.1
  Top Layer w0.508: C13.2 116.39,32.68 R3.2 116.39,35.65 RT3.2 113.33,42.32 112.66,42.99 U13.5
$1N12389: length 3.5
  Top Layer w0.508: U2.7 46.56,56.63 R6.1
$1N12395: length 7.4
  Top Layer w0.508: CN1.1 U2.8
$1N12398: length 8.4
  Top Layer w0.508: v1(47.82,55) 47.83,54.98 U2.6
  Bottom Layer w0.508: v1(47.82,55) 50.29,57.47 CN1.3
$1N13149: length 3.5
  Top Layer w0.508: R8.1 59.59,56.62 59.59,53.21
$1N13151: length 7.4
  Top Layer w0.508: CN2.1 U4.8
$1N13153: length 8.4
  Top Layer w0.508: U4.6 60.86,55.04 v1(60.86,55.05)
  Bottom Layer w0.508: CN2.3 63.32,57.51 v1(60.86,55.05)
$1N13495: length 3.4
  Top Layer w0.508: U1.7 R5.1
$1N13497: length 7.4
  Top Layer w0.508: U1.8 84.39,53.22 CN4.1
$1N13499: length 8.4
  Top Layer w0.508: v1(86.96,55.04) 86.92,55 U1.6
  Bottom Layer w0.508: CN4.3 89.39,57.53 86.96,55.1 v1(86.96,55.04)
$1N13841: length 3.5
  Top Layer w0.508: R7.1 72.63,53.22 U3.7
$1N13843: length 7.4
  Top Layer w0.508: U3.8 71.36,53.22 CN3.1
$1N13845: length 8.4
  Top Layer w0.508: v1(73.88,54.96) 73.89,54.95 U3.6
  Bottom Layer w0.508: v1(73.88,54.96) 76.36,57.44 CN3.3
$2N1963: length 26.7
  Top Layer w0.635: v2(107.26,9.31) 107.85,9.9 107.85,11.34
  Top Layer w0.762: BT1.1 92.7,23.68 97.98,18.39 v2(102.28,18.39)
  Bottom Layer w0.762: v2(102.28,18.39) 106.78,13.89 106.78,9.79 v2(107.26,9.31)
$2N2085: length 2.6
  Top Layer w0.508: R21.2 112.25,11.34
$2N2141: length 3.1
  Top Layer w0.508: R22.2 111.15,12.78 111.15,11.34
$2N2347: length 4.1
  Top Layer w0.508: 110.05,11.34 110.05,12.38 109.63,12.79 108.73,12.79 107.73,13.8 R23.2
$2N2350: length 2.5
  Top Layer w0.508: 107.96,18.33 107.96,16.17 R23.1
$2N3257: length 3
  Top Layer w0.254: R19.2 69.66,6.01 U5.9
$2N3275: length 4.2
  Top Layer w0.254: 68.09,6.53 U5.10 68.88,6.51 69.41,7.04 69.41,7.95 C32.1
$2N3619: length 3.1
  Top Layer w0.254: 64.05,6.99 U5.20 63.45,7.01 63.22,7.24 63.22,7.82 C31.2
$2N3742: length 3.2
  Top Layer w0.254: H1.3 67.32,3.63 U5.6
$2N3752: length 3.2
  Top Layer w0.254: H1.2 U5.7
$2N4604: length 3.2
  Top Layer w0.762: R11.2 27.82,55.56 CN5.4
$2N4608: length 3.2
  Top Layer w0.762: CN5.5 R10.2
$2N4932: length 7
  Top Layer w0.762: CN5.2 CN5.3 30.31,53.12 29.72,52.53 Q1.3
$2N5169: length 4.5
  Top Layer w0.508: 29.83,48.37 25.37,48.37 R12.1
$2N5247: length 7.2
  Top Layer w0.508: Q2.3 32.03,50.36 Q1.1
  Top Layer w0.762: C27.1 36.16,50.32 R9.1 33.8,50.37 Q1.1
$3N4980: length 2.3
  Top Layer w0.254: R29.1 45.63,9.87 USB1.10
$3N4986: length 2.3
  Top Layer w0.254: R30.1 42.63,9.87 USB1.4
$3N6297: length 8.7
  Top Layer w0.508: R31.2 82.31,23.11 U14.5 85,23.16
  Top Layer w0.762: R32.2 85,23.16 85,27.04
$3N44749: length 19.4
  Top Layer w0.355: U9.2 U9.3 14.41,43.08 13.78,43.71 9.06,43.71 D5.1
  Top Layer w0.762: 4.65,46.13 5.18,45.6 8.87,45.6 C43.1
  Top Layer w1.27: D5.1 5.9,42.96 4.65,44.21 C42.1
$3N44776: length 2.4
  Top Layer w0.355: U9.4 13.58,42.56 R27.1
$3N44795: length 1.9
  Top Layer w0.355: R24.2 R25.1
$3N44814: length 2.4
  Top Layer w0.355: R25.2 11.28,38.56 U9.5
$3N44858: length 4.4
  Top Layer w0.355: U9.1 16.03,43.03 C44.2
$3N44891: length 15.7
  Top Layer w0.355: 16.88,38.56 16.88,44.25 C44.1 ; D6.1 18.21,38.56 U9.8
  Top Layer w0.762: L2.1 14.91,48.42 15.35,47.98 C44.1
$3N45050: length 7.1
  Top Layer w0.508: U14.3 78.13,24.43 78.28,24.28 78.28,21.51 R34.1 80.1,21.15 R33.1
$4N1687: length 5
  Top Layer w0.254: 56.51,29.49 57.68,29.49 59.08,30.89 R42.1
$4N1976: length 13.8
  Top Layer w0.254: 56.51,26.49 54.23,26.49 53.35,25.61 53.35,24.38 56.6,21.13 56.6,20.53 57.36,19.77 R40.1 59.69,19.31 C55.1
$4N3396: length 41.5
  Top Layer w0.254: v2(76.47,10.74) 77.2,10.01 R43.2 ; U11.49 47.02,23.28 47.31,23.56 49.4,23.56 50.3,24.46 50.33,24.46 v2(50.36,24.44)
  Bottom Layer w0.254: v2(50.36,24.44) 50.36,22.88 62.5,10.74 v2(76.47,10.74)
$4N3397: length 4
  Top Layer w0.254: H2.1 77.2,2.23 R43.1
$4N3426: length 45.4
  Top Layer w0.254: R45.2 82.25,7.7 82.25,9.59 v2(81.97,9.87) ; v2(47.96,24.51) 47.95,24.5 U11.46
  Bottom Layer w0.254: 47.96,24.51 62.6,9.87 v2(81.97,9.87)
$4N3427: length 4.6
  Top Layer w0.254: R45.1 84.53,3.41 H2.4
$4N3881: length 4.7
  Top Layer w0.762: R41.1 25.35,2.75 PR2.2

## Copper pours and planes (outline as drawn; the poured copper is in the pictures)
GND on Top Layer: -4.77,67.51 123.64,67.51 123.64,-1.04 -4.77,-1.04
GND on Bottom Layer: -4.04,69.1 126.44,69.1 126.44,-3.49 -4.04,-3.49

Small or netless copper shapes (teardrops, artwork), in the pictures only: 478 on Top Layer, 78 on Bottom Layer
